# EAGLE design x49_dash (EAGLE 9.3.1)
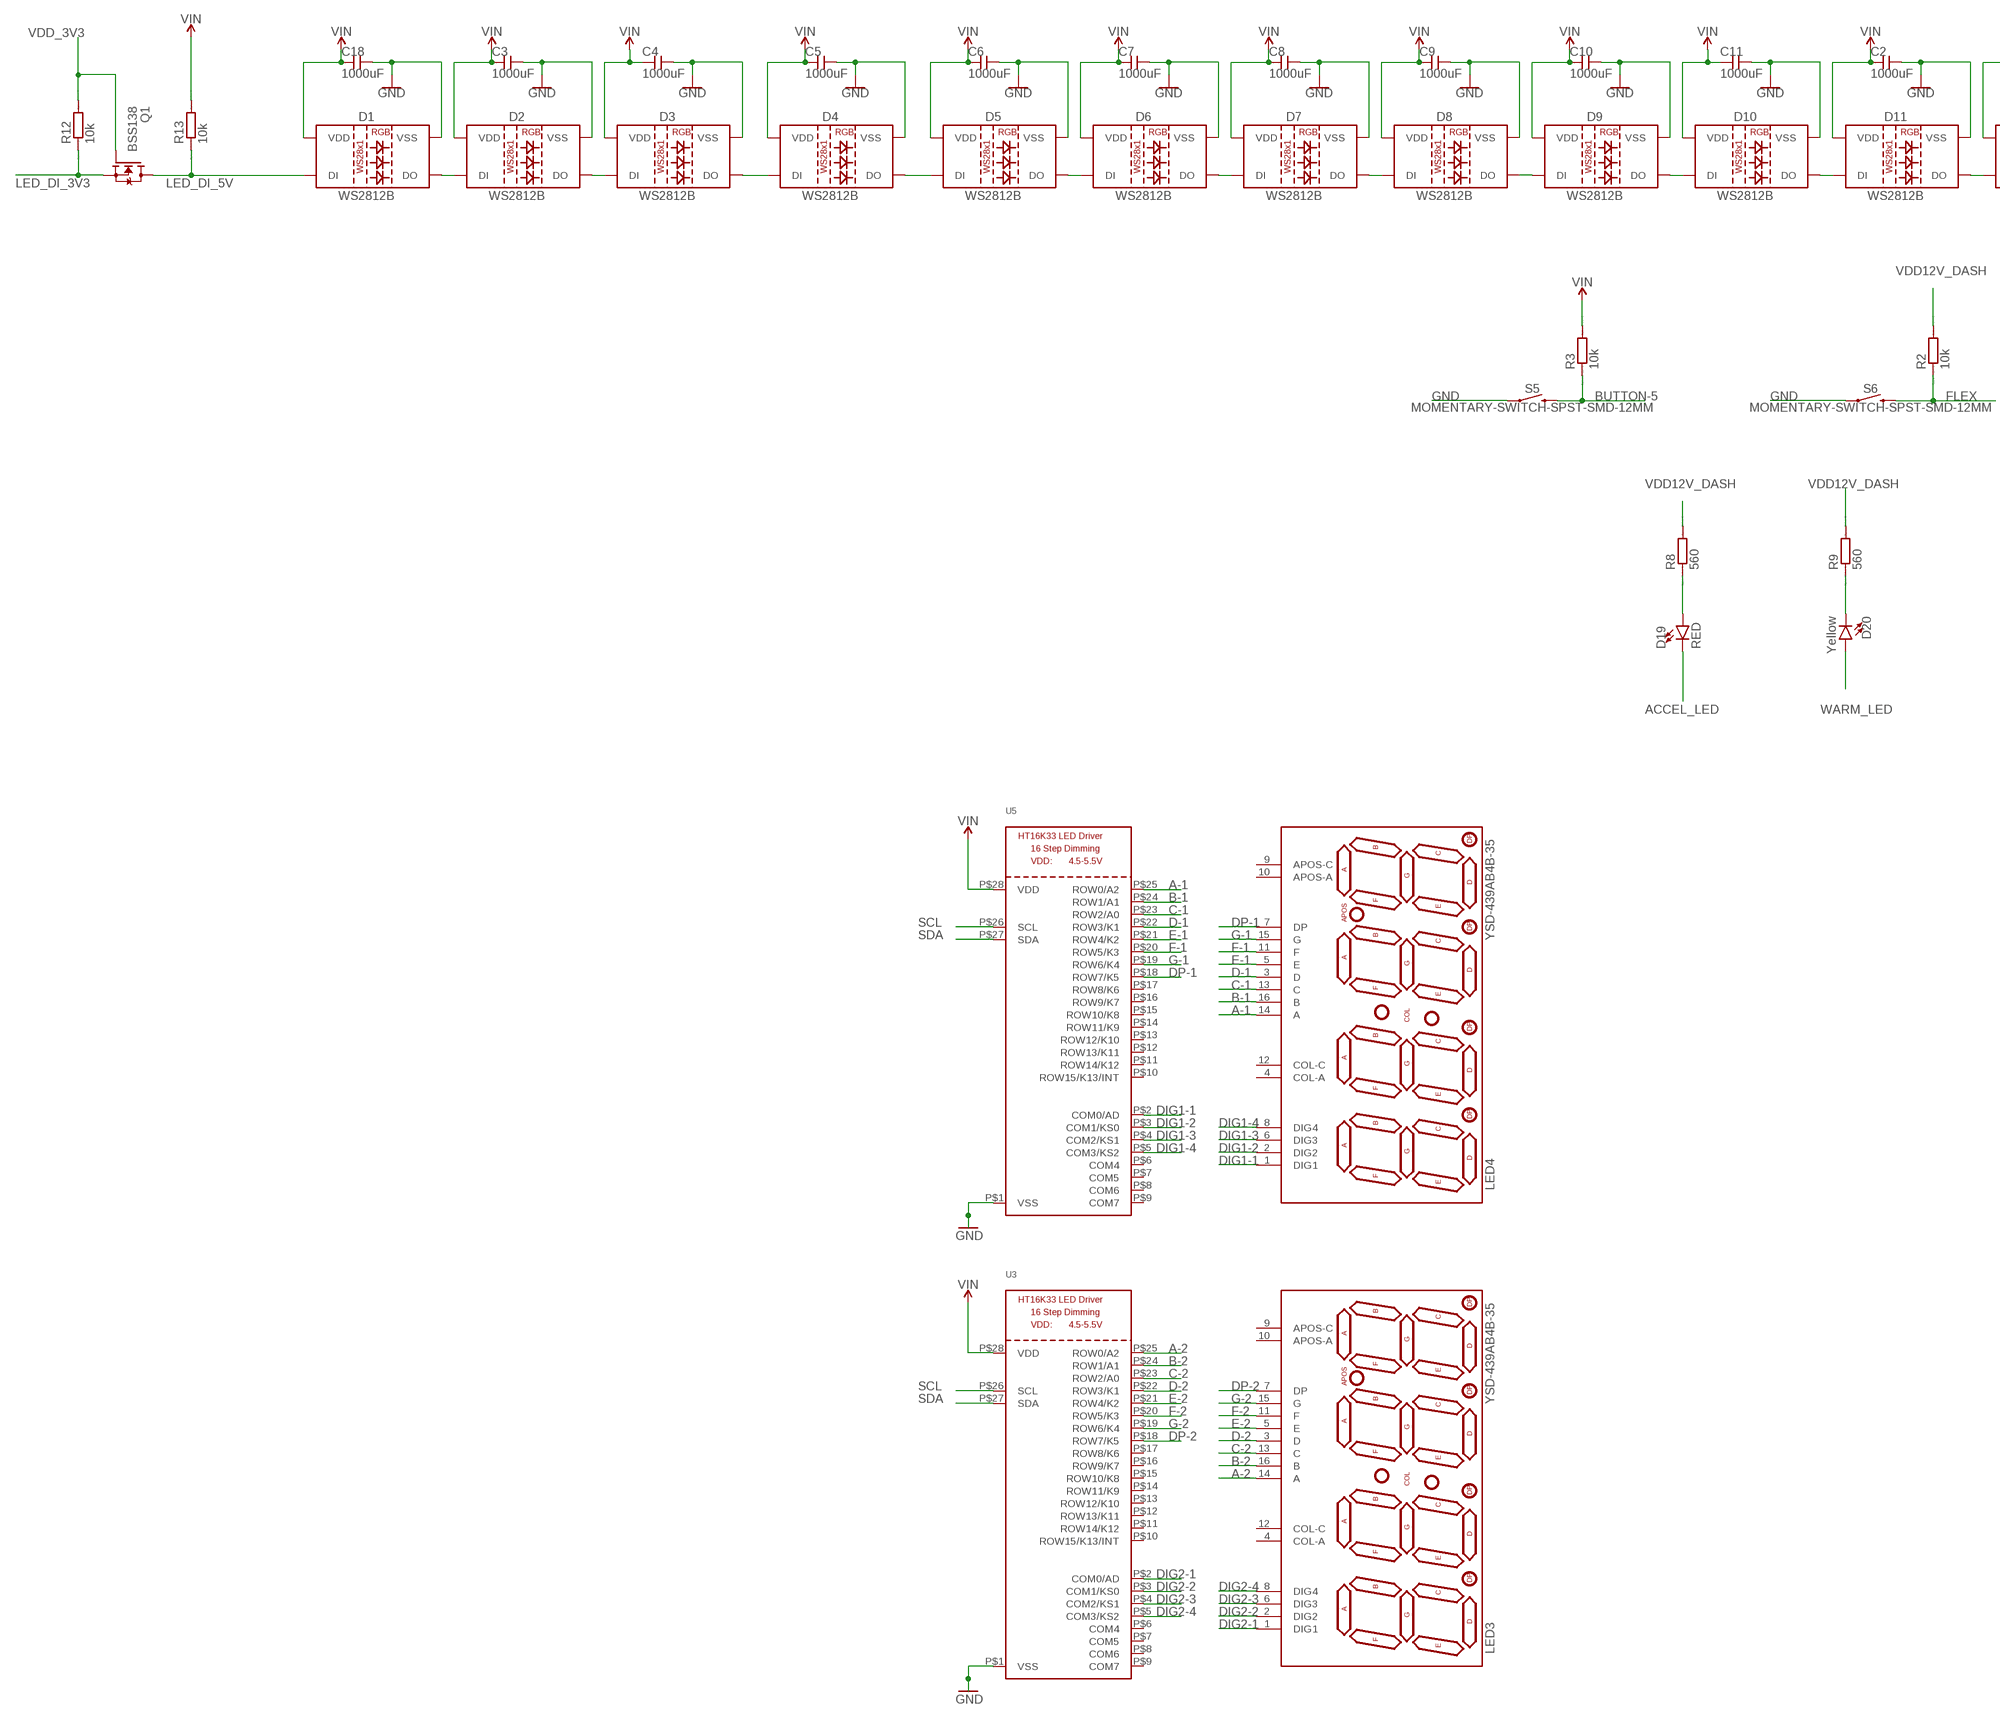
[diagram p0: schematic, sheet 1, part 1 of 2]
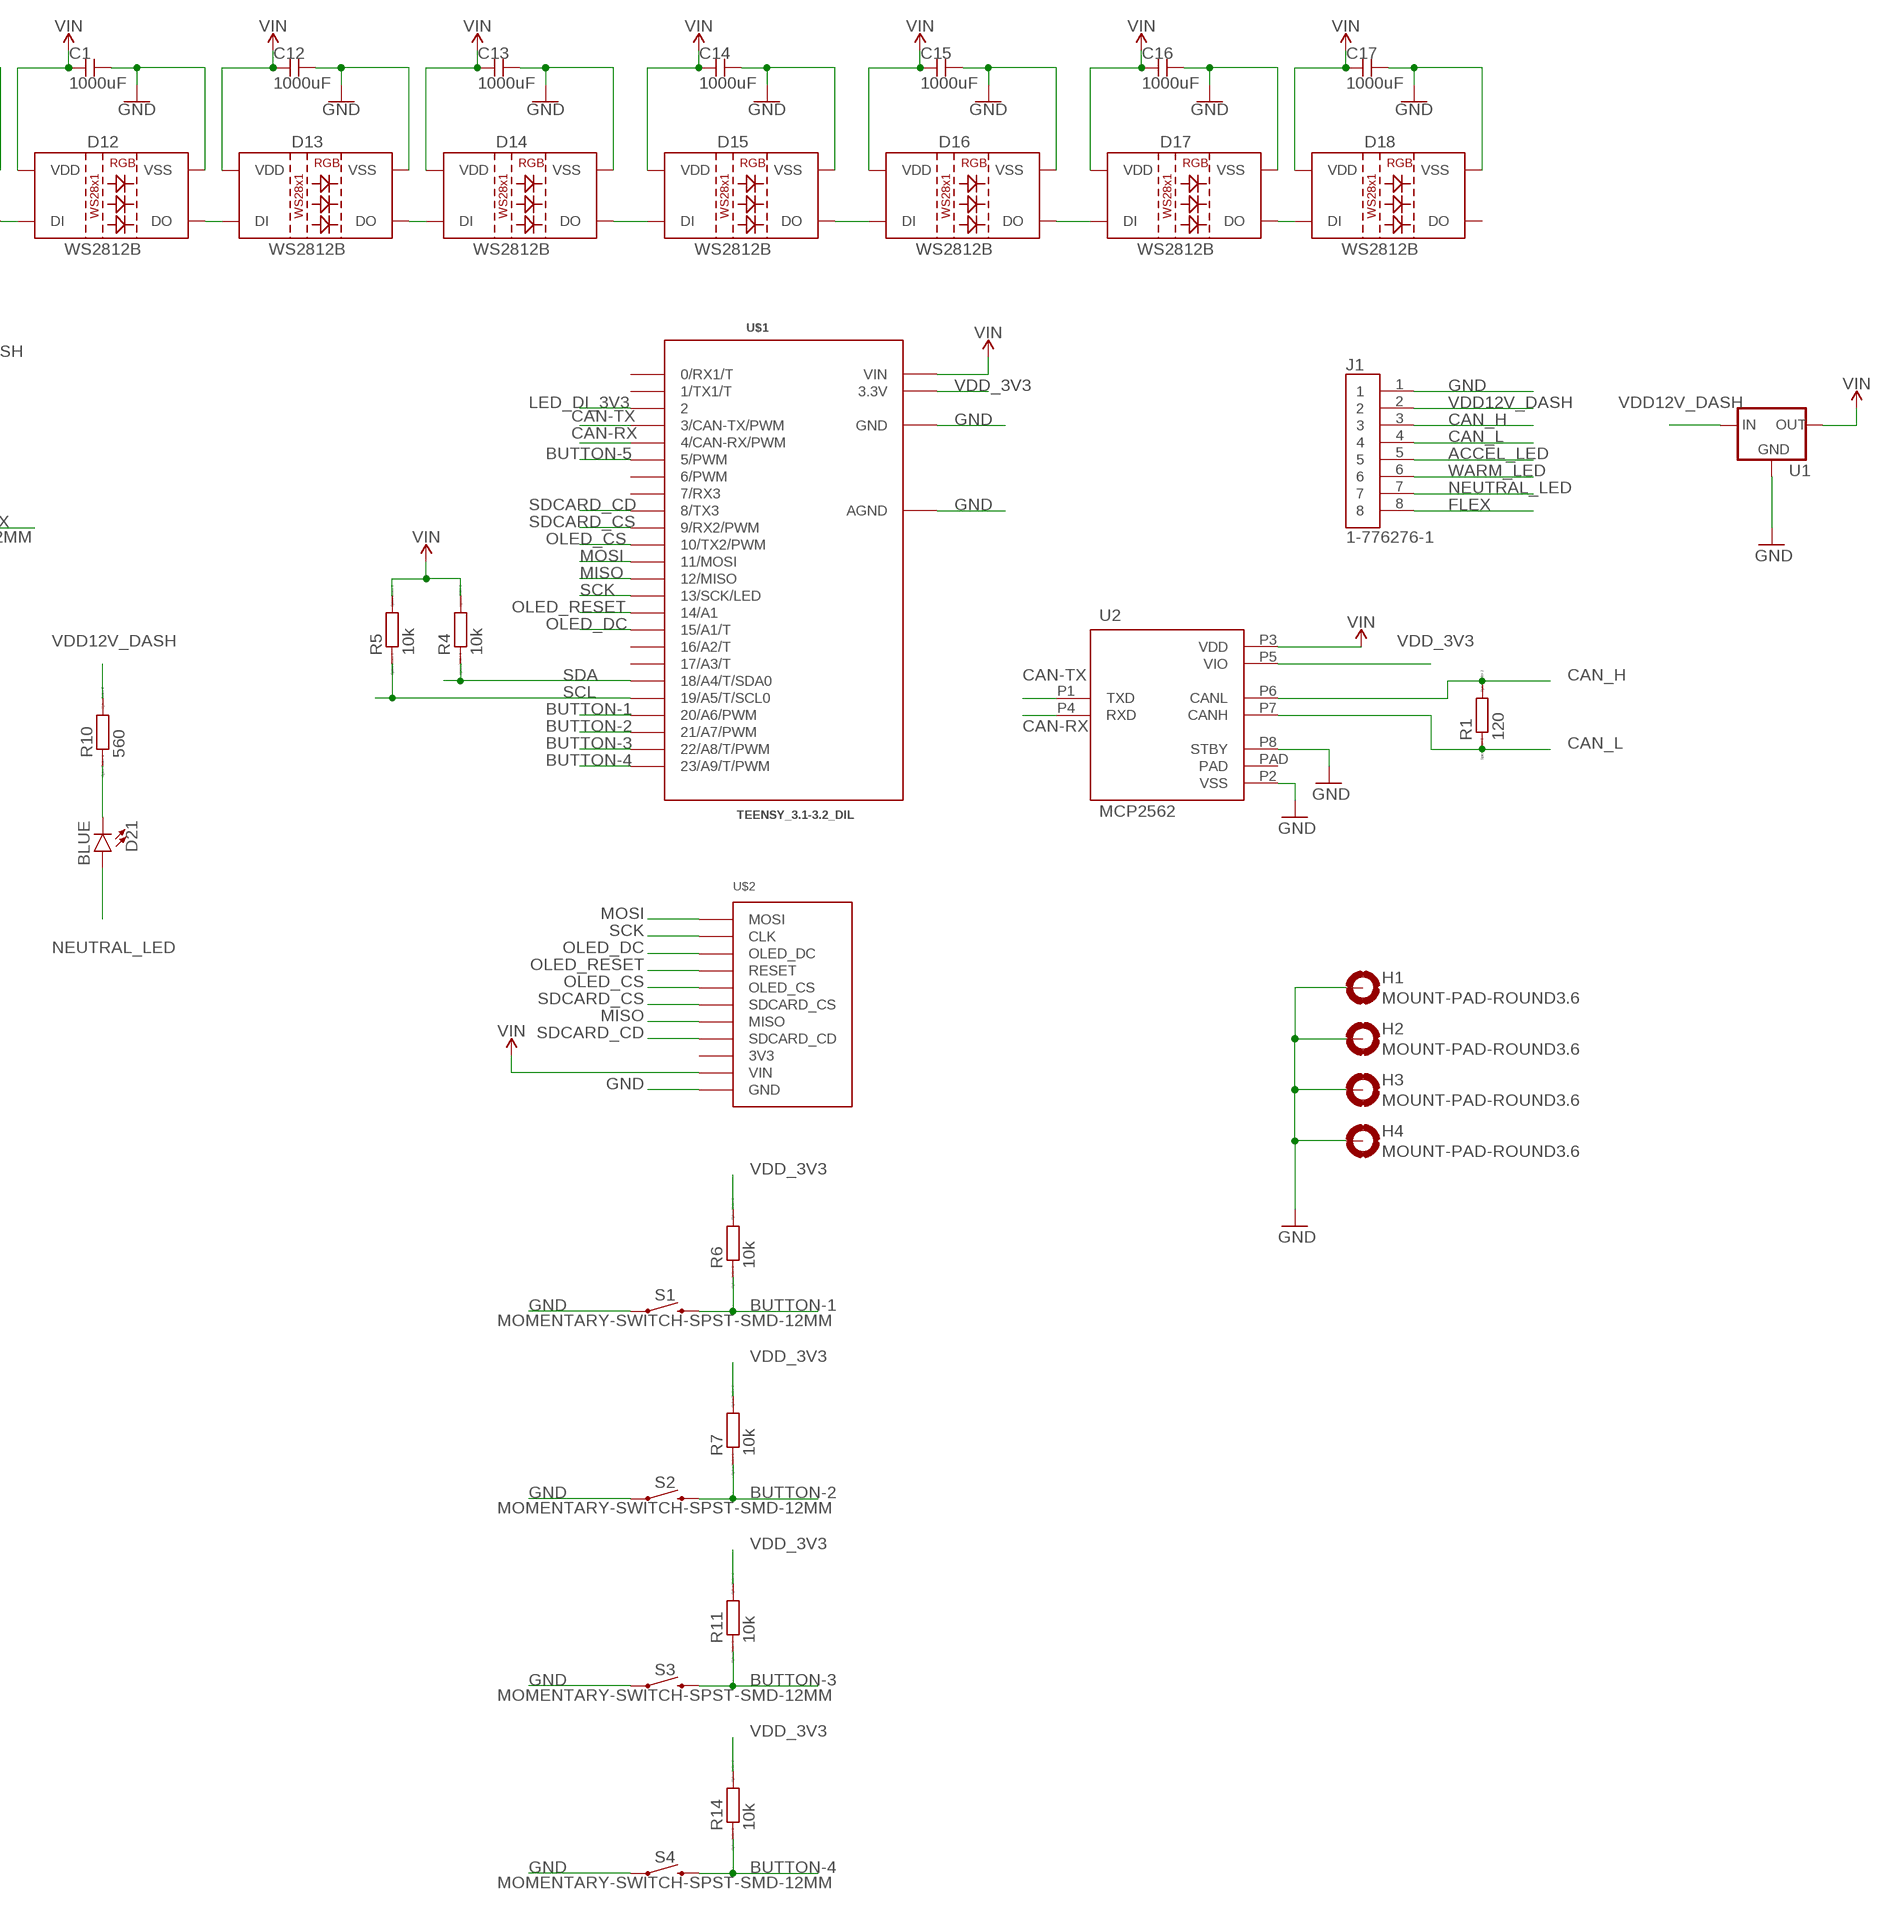
[diagram p1: schematic, sheet 1, part 2 of 2]

## Parts
C1  1000uF  CAP-1005  [1005]
C2  1000uF  CAP-1005  [1005]
C3  1000uF  CAP-1005  [1005]
C4  1000uF  CAP-1005  [1005]
C5  1000uF  CAP-1005  [1005]
C6  1000uF  CAP-1005  [1005]
C7  1000uF  CAP-1005  [1005]
C8  1000uF  CAP-1005  [1005]
C9  1000uF  CAP-1005  [1005]
C10  1000uF  CAP-1005  [1005]
C11  1000uF  CAP-1005  [1005]
C12  1000uF  CAP-1005  [1005]
C13  1000uF  CAP-1005  [1005]
C14  1000uF  CAP-1005  [1005]
C15  1000uF  CAP-1005  [1005]
C16  1000uF  CAP-1005  [1005]
C17  1000uF  CAP-1005  [1005]
C18  1000uF  CAP-1005  [1005]
D1  WS2812B  [WS2812B]
D2  WS2812B  [WS2812B]
D3  WS2812B  [WS2812B]
D4  WS2812B  [WS2812B]
D5  WS2812B  [WS2812B]
D6  WS2812B  [WS2812B]
D7  WS2812B  [WS2812B]
D8  WS2812B  [WS2812B]
D9  WS2812B  [WS2812B]
D10  WS2812B  [WS2812B]
D11  WS2812B  [WS2812B]
D12  WS2812B  [WS2812B]
D13  WS2812B  [WS2812B]
D14  WS2812B  [WS2812B]
D15  WS2812B  [WS2812B]
D16  WS2812B  [WS2812B]
D17  WS2812B  [WS2812B]
D18  WS2812B  [WS2812B]
D19  RED  LED-RED0603  [LED-0603]
D20  Yellow  LED-YELLOW0603  [LED-0603]
D21  BLUE  LED-BLUE0603  [LED-0603]
H1  MOUNT-PAD-ROUND3.6  [3,6-PAD]
H2  MOUNT-PAD-ROUND3.6  [3,6-PAD]
H3  MOUNT-PAD-ROUND3.6  [3,6-PAD]
H4  MOUNT-PAD-ROUND3.6  [3,6-PAD]
J1  1-776276-1  [TE_1-776276-1]
LED3  YSD-439AB4B-35  7-SEGMENT-4DIGIT-10MM-BLUE  [7-SEGMENT-4DIGIT-YOUNGSUN]
LED4  YSD-439AB4B-35  7-SEGMENT-4DIGIT-10MM-BLUE  [7-SEGMENT-4DIGIT-YOUNGSUN]
Q1  BSS138  [SOT23]
R1  120  R  [R0805]
R2  10k  R  [R0805]
R3  10k  R  [R0805]
R4  10k  R  [R0805]
R5  10k  R  [R0805]
R6  10k  R  [R0805]
R7  10k  R  [R0805]
R8  560  R  [R0805]
R9  560  R  [R0805]
R10  560  R  [R0805]
R11  10k  R  [R0805]
R12  10k  R  [R0805]
R13  10k  R  [R0805]
R14  10k  R  [R0805]
S1  MOMENTARY-SWITCH-SPST-SMD-12MM  [TACTILE_SWITCH_SMD_12MM]
S2  MOMENTARY-SWITCH-SPST-SMD-12MM  [TACTILE_SWITCH_SMD_12MM]
S3  MOMENTARY-SWITCH-SPST-SMD-12MM  [TACTILE_SWITCH_SMD_12MM]
S4  MOMENTARY-SWITCH-SPST-SMD-12MM  [TACTILE_SWITCH_SMD_12MM]
S5  MOMENTARY-SWITCH-SPST-SMD-12MM  [TACTILE_SWITCH_SMD_12MM]
S6  MOMENTARY-SWITCH-SPST-SMD-12MM  [TACTILE_SWITCH_SMD_12MM]
U1  +12v  V_REG_78XX7812  [TO-252]
U2  MCP2562  [DFN3X3]
U3  HT16K33_SOP28  [SOP28_300MIL]
U5  HT16K33_SOP28  [SOP28_300MIL]
U$1  TEENSY_3.1-3.2_DIL  [TEENSY_3.0-3.2&LC_DIL]
U$2  ADAFRUIT-OLED-BREAKOUT  [OLED-1.27INCH-BREAKOUT]

## Nets
A-1: LED4.14(A) U5.P$25(ROW0/A2)
A-2: LED3.14(A) U3.P$25(ROW0/A2)
ACCEL_LED: D19.C J1.5
B-1: LED4.16(B) U5.P$24(ROW1/A1)
B-2: LED3.16(B) U3.P$24(ROW1/A1)
BUTTON-1: R6.1 S1.3 U$1.20/A6(20/A6/PWM)
BUTTON-2: R7.1 S2.3 U$1.21/A7(21/A7/PWM)
BUTTON-3: R11.1 S3.3 U$1.22/A8(22/A8/T/PWM)
BUTTON-4: R14.1 S4.3 U$1.23/A9(23/A9/T/PWM)
BUTTON-5: R3.1 S5.3 U$1.5(5/PWM)
C-1: LED4.13(C) U5.P$23(ROW2/A0)
C-2: LED3.13(C) U3.P$23(ROW2/A0)
CAN-RX: U2.P4(RXD) U$1.4(4/CAN-RX/PWM)
CAN-TX: U2.P1(TXD) U$1.3(3/CAN-TX/PWM)
CAN_H: J1.3 R1.2 U2.P6(CANL)
CAN_L: J1.4 R1.1 U2.P7(CANH)
D-1: LED4.3(D) U5.P$22(ROW3/K1)
D-2: LED3.3(D) U3.P$22(ROW3/K1)
DIG1-1: LED4.1(DIG1) U5.P$2(COM0/AD)
DIG1-2: LED4.2(DIG2) U5.P$3(COM1/KS0)
DIG1-3: LED4.6(DIG3) U5.P$4(COM2/KS1)
DIG1-4: LED4.8(DIG4) U5.P$5(COM3/KS2)
DIG2-1: LED3.1(DIG1) U3.P$2(COM0/AD)
DIG2-2: LED3.2(DIG2) U3.P$3(COM1/KS0)
DIG2-3: LED3.6(DIG3) U3.P$4(COM2/KS1)
DIG2-4: LED3.8(DIG4) U3.P$5(COM3/KS2)
DP-1: LED4.7(DP) U5.P$18(ROW7/K5)
DP-2: LED3.7(DP) U3.P$18(ROW7/K5)
E-1: LED4.5(E) U5.P$21(ROW4/K2)
E-2: LED3.5(E) U3.P$21(ROW4/K2)
F-1: LED4.11(F) U5.P$20(ROW5/K3)
F-2: LED3.11(F) U3.P$20(ROW5/K3)
FLEX: J1.8 R2.1 S6.3
G-1: LED4.15(G) U5.P$19(ROW6/K4)
G-2: LED3.15(G) U3.P$19(ROW6/K4)
GND: C1.P$2 C2.P$2 C3.P$2 C4.P$2 C5.P$2 C6.P$2 C7.P$2 C8.P$2 C9.P$2 C10.P$2 C11.P$2 C12.P$2 C13.P$2 C14.P$2 C15.P$2 C16.P$2 C17.P$2 C18.P$2 D1.3(VSS) D2.3(VSS) D3.3(VSS) D4.3(VSS) D5.3(VSS) D6.3(VSS) D7.3(VSS) D8.3(VSS) D9.3(VSS) D10.3(VSS) D11.3(VSS) D12.3(VSS) D13.3(VSS) D14.3(VSS) D15.3(VSS) D16.3(VSS) D17.3(VSS) D18.3(VSS) H1.B3,6(MOUNT) H2.B3,6(MOUNT) H3.B3,6(MOUNT) H4.B3,6(MOUNT) J1.1 S1.1 S2.1 S3.1 S4.1 S5.1 S6.1 U1.3(GND) U2.P2(VSS) U2.P8(STBY) U3.P$1(VSS) U5.P$1(VSS) U$1.AGND U$1.GND U$2.11(GND) U$2.P$1(GND) U$2.P$2(GND) U$2.P$3(GND) U$2.P$4(GND)
LED_DI_3V3: Q1.2(S) R12.1 U$1.2
LED_DI_5V: D1.4(DI) Q1.3(D) R13.1
MISO: U$1.12(12/MISO) U$2.7(MISO)
MOSI: U$1.11(11/MOSI) U$2.1(MOSI)
N$1: D19.A R8.1
N$2: D1.2(DO) D2.4(DI)
N$3: D20.C R9.1
N$4: D21.C R10.1
N$6: D7.2(DO) D8.4(DI)
N$7: D8.2(DO) D9.4(DI)
N$8: D9.2(DO) D10.4(DI)
N$9: D10.2(DO) D11.4(DI)
N$10: D11.2(DO) D12.4(DI)
N$11: D12.2(DO) D13.4(DI)
N$12: D13.2(DO) D14.4(DI)
N$13: D2.2(DO) D3.4(DI)
N$14: D3.2(DO) D4.4(DI)
N$15: D4.2(DO) D5.4(DI)
N$16: D5.2(DO) D6.4(DI)
N$17: D6.2(DO) D7.4(DI)
N$18: D15.2(DO) D16.4(DI)
N$19: D16.2(DO) D17.4(DI)
N$20: D17.2(DO) D18.4(DI)
N$21: D14.2(DO) D15.4(DI)
NEUTRAL_LED: D21.A J1.7
OLED_CS: U$1.10(10/TX2/PWM) U$2.5(OLED_CS)
OLED_DC: U$1.15/A1(15/A1/T) U$2.3(OLED_DC)
OLED_RESET: U$1.14/A0(14/A1) U$2.4(RESET)
SCK: U$1.13(13/SCK/LED) U$2.2(CLK)
SCL: R5.1 U3.P$26(SCL) U5.P$26(SCL) U$1.19/A5(19/A5/T/SCL0)
SDA: R4.1 U3.P$27(SDA) U5.P$27(SDA) U$1.18/A4(18/A4/T/SDA0)
SDCARD_CD: U$1.8(8/TX3) U$2.8(SDCARD_CD)
SDCARD_CS: U$1.9(9/RX2/PWM) U$2.6(SDCARD_CS)
VDD12V_DASH [pwr]: J1.2 R2.2 R8.2 R9.2 R10.2 U1.1(IN)
VDD_3V3: Q1.1(G) R6.2 R7.2 R11.2 R12.2 R14.2 U2.P5(VIO) U$1.3.3V
VIN [pwr]: C1.P$1 C2.P$1 C3.P$1 C4.P$1 C5.P$1 C6.P$1 C7.P$1 C8.P$1 C9.P$1 C10.P$1 C11.P$1 C12.P$1 C13.P$1 C14.P$1 C15.P$1 C16.P$1 C17.P$1 C18.P$1 D1.1(VDD) D2.1(VDD) D3.1(VDD) D4.1(VDD) D5.1(VDD) D6.1(VDD) D7.1(VDD) D8.1(VDD) D9.1(VDD) D10.1(VDD) D11.1(VDD) D12.1(VDD) D13.1(VDD) D14.1(VDD) D15.1(VDD) D16.1(VDD) D17.1(VDD) D18.1(VDD) R3.2 R4.2 R5.2 R13.2 U1.2(OUT) U2.P3(VDD) U3.P$28(VDD) U5.P$28(VDD) U$1.VIN U$2.10(VIN)
WARM_LED: D20.A J1.6
Unconnected: D18.2(DO) LED3.4(COL-A) LED3.9(APOS-C) LED3.10(APOS-A) LED3.12(COL-C) LED4.4(COL-A) LED4.9(APOS-C) LED4.10(APOS-A) LED4.12(COL-C) U2.PAD U3.P$6(COM4) U3.P$7(COM5) U3.P$8(COM6) U3.P$9(COM7) U3.P$10(ROW15/K13/INT) U3.P$11(ROW14/K12) U3.P$12(ROW13/K11) U3.P$13(ROW12/K10) U3.P$14(ROW11/K9) U3.P$15(ROW10/K8) U3.P$16(ROW9/K7) U3.P$17(ROW8/K6) U5.P$6(COM4) U5.P$7(COM5) U5.P$8(COM6) U5.P$9(COM7) U5.P$10(ROW15/K13/INT) U5.P$11(ROW14/K12) U5.P$12(ROW13/K11) U5.P$13(ROW12/K10) U5.P$14(ROW11/K9) U5.P$15(ROW10/K8) U5.P$16(ROW9/K7) U5.P$17(ROW8/K6) U$1.0(0/RX1/T) U$1.1(1/TX1/T) U$1.6(6/PWM) U$1.7(7/RX3) U$1.16/A2(16/A2/T) U$1.17/A3(17/A3/T)

## Power pins joined to a net without a drawn wire
3V3: U$2.9(3V3)

## Library data of the parts
C1-C18 = scenix4:CAP-1005
D1-D18 = SparkFun-LED:WS2812B: WS2812B SMD addressable RGB LED 5x5mm SMD LED with built-in controller IC. Color: Red/Green/Blue mC Rating: RGB: 390, 660, 180 mcd Forward Voltage: RGB: 2.0, 3.0, 3.0 V Packages:WS2812B SparkFun Products: Blynk Board - ESP8266 <https://www.sparkfun.com/products/13794>; PROD_ID: DIO-12503
D19 = SparkFun-LED:LED-RED: Red SMD LED Used in manufacturing of most products at SparkFun Packages: 0603 - SMD 0603 package [Product Link] <http://docs.avagotech.com/docs/AV02-0551EN> 0603 SMART - SMD 0603 SMART package ( more efficient and expensive)[Product Link] <http://www.osram-os.com/Graphics/XPic2/00077099_0.pdf> 1206 - SMD1206 package [Product Link] <https://www.sparkfun.com/datasheets/DevTools/LilyPad/Q150OVS4.pdff> SparkFun Products: Pro Mini 328 -5V <https://www.sparkfun.com/products/821> RedBoard <https://www.sparkfun.com/products/12757> IOIO-OTG <https://www.sparkfun.com/products/13613>; PROD_ID: DIO-00819
D20 = SparkFun-LED:LED-YELLOW: Yellow SMD LED Used in manufacturing several products at SparkFun. Packages: 0603 - SMD 0603 package[Product Link] <http://www.kingbrightusa.com/product.asp?catalog_name=LED&product_id=APT1608SYCK> 0603 -SMART - SMART SMD 0603 package (more efficient/more expensive) [Product Link] <http://www.osram-os.com/osram_os/en/products/product-catalog/led-light-emitting-diodes/smartled-0603/ly-l29k/index.jsp> LilyPad - SMD1206 package[Product Datasheet] <https://www.sparkfun.com/datasheets/DevTools/LilyPad/Q150YUS4.pdf> SparkFun Products: Blynk Board <https://www.sparkfun.com/products/13794> IOIO-OTG <https://www.sparkfun.com/products/13613> XBee Explorer Serial <https://www.sparkfun.com/products/13225>; PROD_ID: DIO-09003
D21 = SparkFun-LED:LED-BLUE: Blue SMD LED Used in manufacturing of various products at SparkFun Packages: 0603 - SMD 0603 package [Product Link] <http://www.digikey.com/product-detail/en/SMLE12BC7TT86/511-1589-2-ND/1641808> 1206 - SMD1206 package [Product Link] <http://www.digikey.com/product-detail/en/lite-on-inc/LTST-C150TBKT/160-1643-1-ND/573584> SparkFun Products: ESP8266 Thing-Dev Board <https://www.sparkfun.com/products/13711> RedBoard <https://www.sparkfun.com/products/12757>; PROD_ID: DIO-08575
H1-H4 = holes:MOUNT-PAD-ROUND: MOUNTING PAD, round
J1 = 1-776276-1:1-776276-1: CONN HEADER 8POS VERT GOLD BLK; MANUFACTURER: TE Connectivity; METADATA: Manufacturer recommendations; PARTREV: B9
LED3 LED4 = SparkFun-LED:7-SEGMENT-4DIGIT-10MM: 4 Digit 7 Segment Display This is a part for the 4-Digit 7-segment LEDs from Young Sun. Different from the Digikey LEDs, all 16 pins are used. The LONGPADS Variant is used for a test jig, but you may like it because there is more pad to solder to. If you are concerned about routing space, the standard works just fine though. Datasheets: Red <http://www.sparkfun.com/datasheets/Components/LED/7-Segment/YSD-439AR6B-35.pdf> Yellow <http://www.sparkfun.com/datasheets/Components/LED/7-Segment/YSD-439AY2B-35.pdf> Kelly Green <http://www.sparkfun.com/datasheets/Components/LED/7-Segment/YSD-439AK2B-35.pdf> Blue <http://www.sparkfun.com/datasheets/Components/LED/7-Segment/YSD-439AB4B-35.pdf> White <http://cdn.sparkfun.com/datasheets/Components/LED/ATA3492BW_2.pdf> SparkFun Products Raw Components 7-Segment Display - 4-Digit (Red) <https://www.sparkfun.com/products/9483> (COM-09483) 7-Segment Display - 4-Digit (Yellow) <https://www.sparkfun.com/products/9480> (COM-09480) 7-Segment Display - 4-Digit (Kelly Green) <https://www.sparkfun.com/products/9482> (COM-09482) 7-Segment Display - 4-Digit (Blue) <https://www.sparkfun.com/products/9481> (COM-09481) 7-Segment Display - 4-Digit (White) <https://www.sparkfun.com/products/10931> ( COM-10931) Serial Controlled SparkFun 7-Segment Serial Display - Red <https://www.sparkfun.com/products/11441> (COM-11441) SparkFun 7-Segment Serial Display - Yellow <https://www.sparkfun.com/products/11443> (COM-11443) SparkFun 7-Segment Serial Display - Kelly Green <https://www.sparkfun.com/products/11440> (COM-11440) SparkFun 7-Segment Serial Display - Blue <https://www.sparkfun.com/products/11442> (COM-11442) SparkFun 7-Segment Serial Display - White <https://www.sparkfun.com/products/11629> (COM-11629) Other SparkFun BigTime Watch Kit <https://www.sparkfun.com/products/11734> (KIT-11734); PROD_ID: COMP-09664
Q1 = bss138_10:BSS138: BSS138 N-Channel Logic Level Enhancement Mode Field Effect Transistor Source: http://www.fairchildsemi.com/datasheets/BS/BSS138.pdf; MF: Fairchild; MPN: BSS138; OC_FARNELL: 9845330; OC_NEWARK: 67R2009
R1-R14 = eagle-ltspice:R: RESISTOR, European symbol; SPICEMODEL: NONE; SPICEPREFIX: R
S1-S6 = SparkFun-Switches:MOMENTARY-SWITCH-SPST: Momentary Switch (Pushbutton) - SPST Normally-open (NO) SPST momentary switches (buttons, pushbuttons). Variants PTH-12MM - 12mm square, through-hole Momentary Pushbutton Switch - 12mm Square <https://www.sparkfun.com/products/9190> (COM-09190) PTH-6.0MM, PTH-6.0MM-KIT - 6.0mm square, through-hole Mini Pushbutton Switch <https://www.sparkfun.com/products/97> (COM-00097) KIT package intended for soldering kit's - only one side of pads' copper is exposed. PTH-RIGHT-ANGLE-KIT - Right-angle, through-hole Right Angle Tactile Button <https://www.sparkfun.com/products/10791> - Used on SparkFun BigTime Watch Kit <https://www.sparkfun.com/products/11734> SMD-12MM - 12mm square, surface-mount Tactile Button - SMD (12mm) <https://www.sparkfun.com/products/12993> (COM-12993) Used on SparkFun PicoBoard <https://www.sparkfun.com/products/11888> SMD-4.5MM - 4.5mm Square Trackball Switch Used on SparkFun Blackberry Trackballer Breakout <https://www.sparkfun.com/products/13169> SMD-4.6MMX2.8MM - 4.60mm x 2.80mm, surface mount Used on SparkFun SAMD21 Mini Breakout <https://www.sparkfun.com/products/13664> SMD-5.2MM, SMD-5.2-REDUNDANT - 5.2mm square, surface-mount Mini Pushbutton Switch - SMD <https://www.sparkfun.com/products/8720> (COM-08720) Used on Arduino Pro Mini <https://www.sparkfun.com/products/11114> REDUNDANT package connects both switch circuits together SMD-6.0X3.5MM - 6.0 x 3.5mm, surface mount Momentary Reset Switch SMD <https://www.sparkfun.com/products/8229> (COM-08229) SMD-6.2MM-TALL - 6.2mm square, surface mount Tactile Button - SMD (6mm) <https://www.sparkfun.com/products/12992> Used on SparkFun Digital Sandbox <https://www.sparkfun.com/products/12651> SMD-RIGHT-ANGLE - Right-angle, surface mount Used on SparkFun Block for Intel® Edison - Arduino <https://www.sparkfun.com/products/13036>; PROD_ID: SWCH-11967; SF_SKU: COM-12993
U1 = SparkFun-IC-Power:V_REG_78XX: Voltage Regulator Standard 78xx regulator. IGO (Input Ground Output). Spark Fun Electronics SKU : COM-00107; PROD_ID: VREG-12370
U2 = can:MCP2562
U3 U5 = microbuilder:HT16K33_SOP28
U$1 = Teensy_3_and_LC_Series_Boards_v1.4:TEENSY_3.1-3.2_DIL: Teensy 3.1 or 3.2 in a DIL Layout.
U$2 = adafruit:ADAFRUIT-OLED-BREAKOUT

## Net classes
0 default: width 0.254 mm, drill 0.55 mm
1 pwr: width 0.508 mm, drill 0.55 mm

## Board
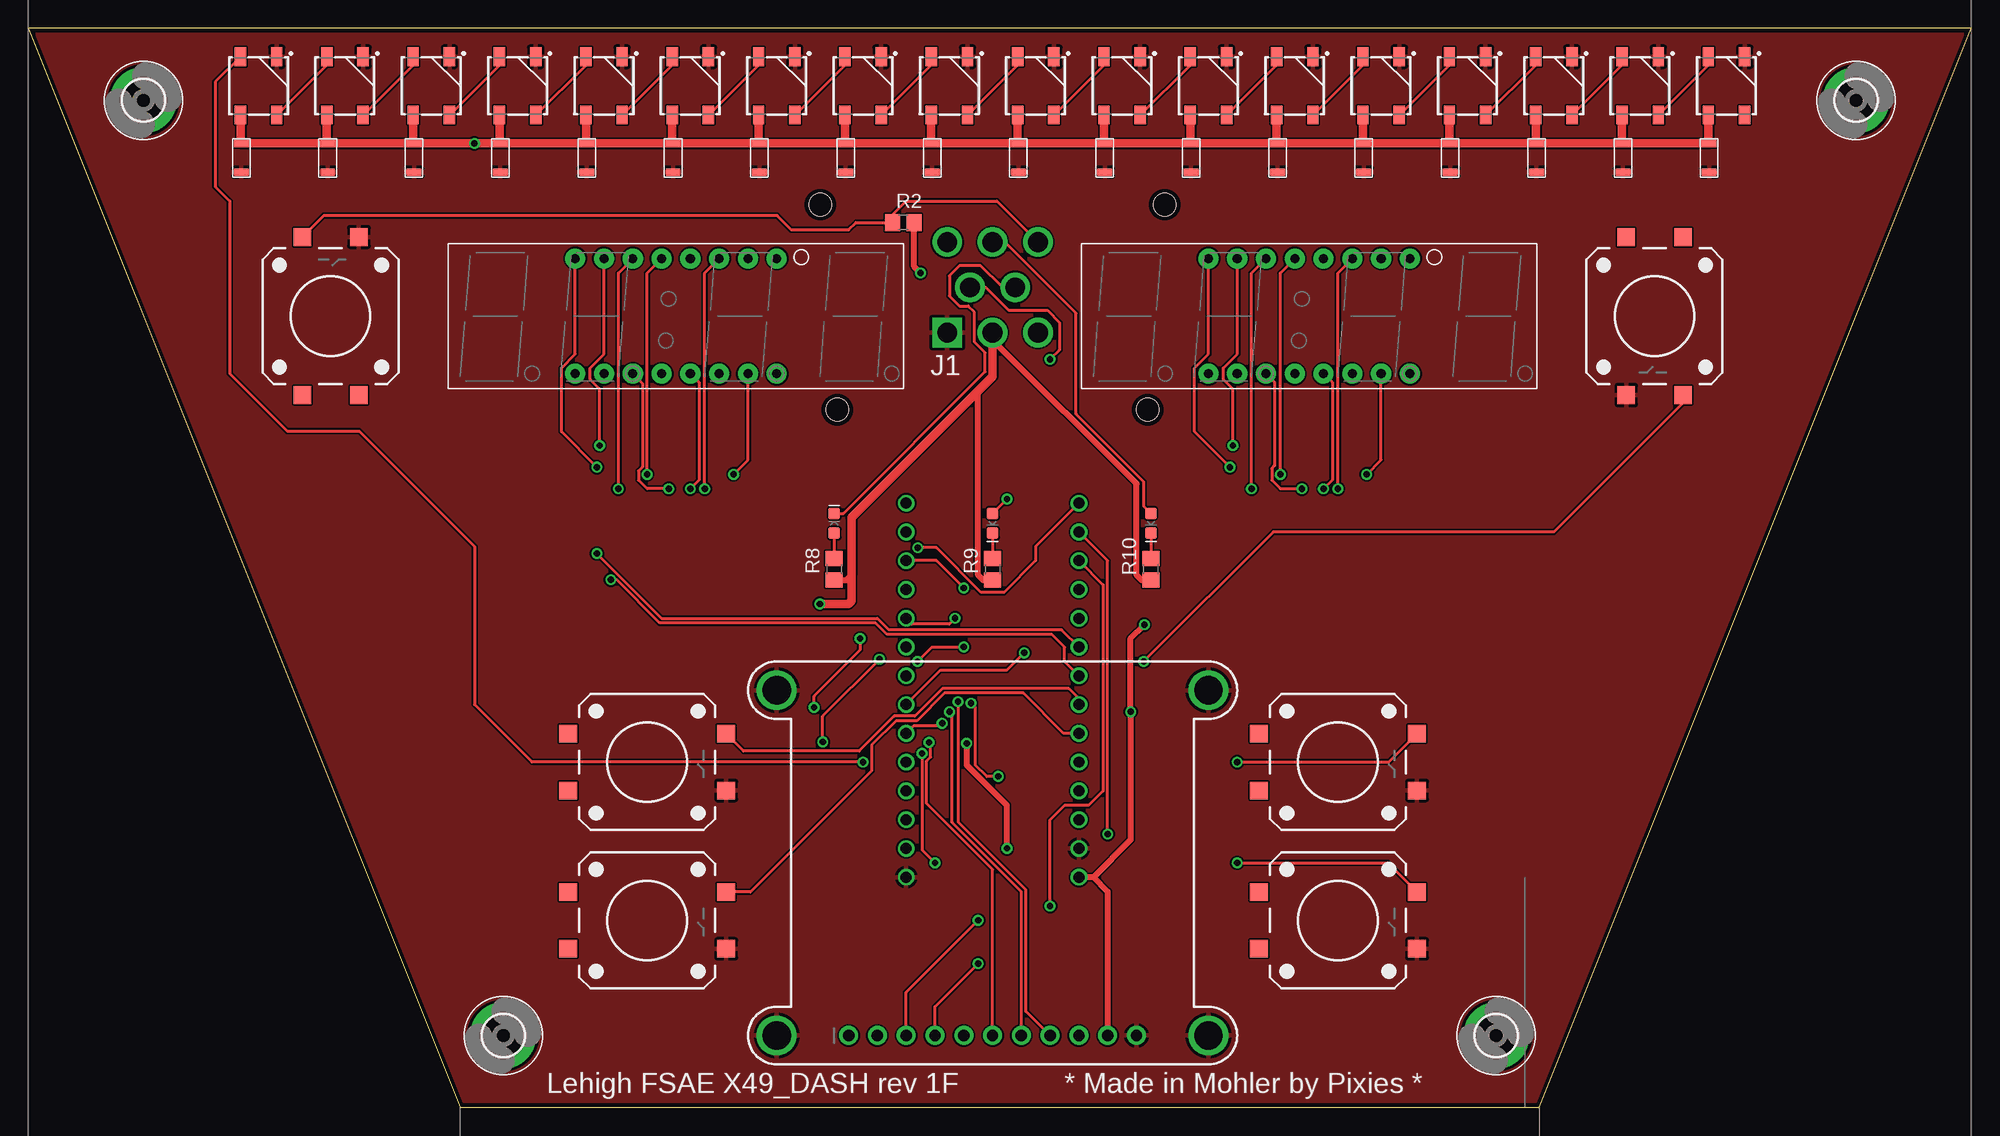
[diagram p2: board, top side]
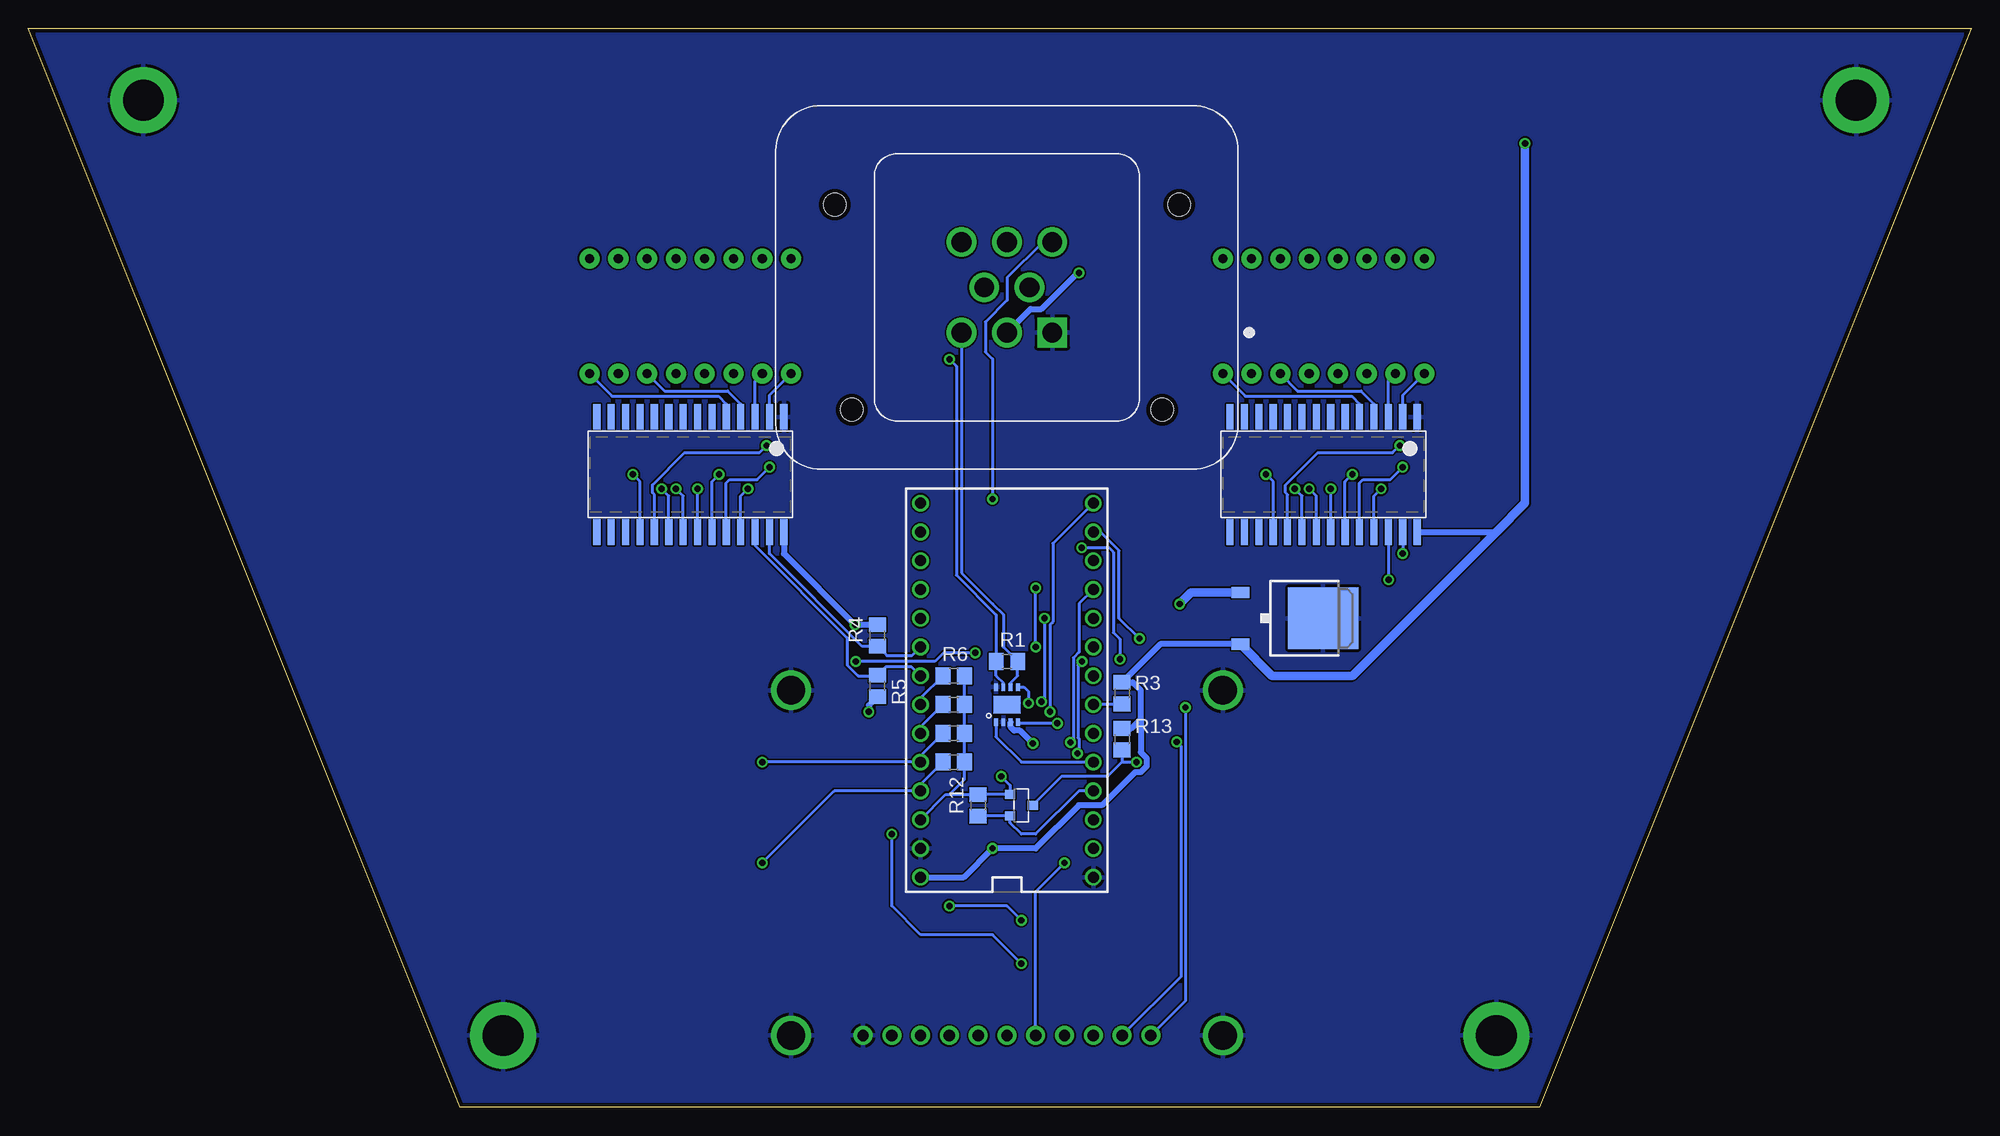
[diagram p3: board, bottom side, seen from below]

Size 171.45 x 95.25 mm. Coordinates in mm from the lower left corner, seen from the top.
Outline: 38.1,0 133.36,0 171.45,95.25 0,95.25 38.1,0
Copper layers (1*16): Top 0.035559375mm / dielectric 1.501140625mm / Bottom 0.035559375mm
Design rules "typical_4pcb": minimum track width 10mil, minimum drill 15mil, track to track 6mil, track to pad 6mil, pad to pad 6mil, via to via 6mil, smd to smd 6mil, copper to edge 15mil, drill to drill 8mil, minimum pad ring 10mil, minimum via ring 8mil, stop-mask expansion 4mil, vias tented up to drill 0mil, thermal gap 10mil

### Footprints (pad centres in the part's own frame; a part is rotated, then mirrored left to right if it is on the bottom)
1005 = smd 0.635 x 1.27: P$1 1.27,0; P$2 -1.27,0
WS2812B = smd 1.651 x 1: 1 2.577,-1.6; 2 2.577,1.6; 3 -2.577,1.6; 4 -2.577,-1.6
LED-0603 = smd 1 x 1: A -0.877,0; C 0.877,0
3,6-PAD = drill 3.6 pad 5.842: B3,6 0,0
TE_1-776276-1 = drill 1.75 square: 1 -4,4 | drill 1.75: 2 0,4; 3 4,4; 4 -2,0; 5 2,0; 6 -4,-4; 7 0,-4; 8 4,-4 | hole 2: -13.7,10.8; 13.7,10.8; -15.2,-7.3; 15.2,-7.3
7-SEGMENT-4DIGIT-YOUNGSUN = drill 0.8 pad 1.778: 1 -8.89,-5.08; 2 -6.35,-5.08; 3 -3.81,-5.08; 4 -1.27,-5.08; 5 1.27,-5.08; 6 3.81,-5.08; 7 6.35,-5.08; 8 8.89,-5.08; 9 8.89,5.08; 10 6.35,5.08; 11 3.81,5.08; 12 1.27,5.08; 13 -1.27,5.08; 14 -3.81,5.08; 15 -6.35,5.08; 16 -8.89,5.08
SOT23 = smd 0.8 x 0.9: 1 -0.95,-1; 2 0.95,-1; 3 0,1
R0805 = smd 1.3 x 1.5: 1 -0.95,0; 2 0.95,0
TACTILE_SWITCH_SMD_12MM = smd 1.6 x 1.55: 1 6.975,-2.5; 2 -6.975,-2.5; 3 6.975,2.5; 4 -6.975,2.5
TO-252 = smd 1 x 1.6: 1 -2.28,-4.8; 2 2.28,-4.8 | smd 5.4 x 6.2: 3 0,2.5
DFN3X3 = smd 0.35 x 0.65: P1 -0.975,-1.55; P2 -0.325,-1.55; P3 0.325,-1.55; P4 0.975,-1.55; P5 0.975,1.55; P6 0.325,1.55; P7 -0.325,1.55; P8 -0.975,1.55 | smd 2.4 x 1.55: PAD 0,0
SOP28_300MIL = smd 0.635 x 2.286: P$1 -8.255,-5.08; P$2 -6.985,-5.08; P$3 -5.715,-5.08; P$4 -4.445,-5.08; P$5 -3.175,-5.08; P$6 -1.905,-5.08; P$7 -0.635,-5.08; P$8 0.635,-5.08; P$9 1.905,-5.08; P$10 3.175,-5.08; P$11 4.445,-5.08; P$12 5.715,-5.08; P$13 6.985,-5.08; P$14 8.255,-5.08; P$15 8.255,5.08; P$16 6.985,5.08; P$17 5.715,5.08; P$18 4.445,5.08; P$19 3.175,5.08; P$20 1.905,5.08; P$21 0.635,5.08; P$22 -0.635,5.08; P$23 -1.905,5.08; P$24 -3.175,5.08; P$25 -4.445,5.08; P$26 -5.715,5.08; P$27 -6.985,5.08; P$28 -8.255,5.08
TEENSY_3.0-3.2&LC_DIL = drill 0.965: 0 -7.62,13.97; 1 -7.62,11.43; 2 -7.62,8.89; 3 -7.62,6.35; 3.3V 7.62,11.43; 4 -7.62,3.81; 5 -7.62,1.27; 6 -7.62,-1.27; 7 -7.62,-3.81; 8 -7.62,-6.35; 9 -7.62,-8.89; 10 -7.62,-11.43; 11 -7.62,-13.97; 12 -7.62,-16.51; 13 7.62,-16.51; 14/A0 7.62,-13.97; 15/A1 7.62,-11.43; 16/A2 7.62,-8.89; 17/A3 7.62,-6.35; 18/A4 7.62,-3.81; 19/A5 7.62,-1.27; 20/A6 7.62,1.27; 21/A7 7.62,3.81; 22/A8 7.62,6.35; 23/A9 7.62,8.89; AGND 7.62,13.97; GND -7.62,16.51; VIN 7.62,16.51
OLED-1.27INCH-BREAKOUT = drill 1 pad 1.676: 1 12.7,15.24; 2 10.16,15.24; 3 7.62,15.24; 4 5.08,15.24; 5 2.54,15.24; 6 0,15.24; 7 -2.54,15.24; 8 -5.08,15.24; 9 -7.62,15.24; 10 -10.16,15.24; 11 -12.7,15.24 | drill 2.5 pad 3.2: P$1 -19.05,15.24; P$2 19.05,15.24; P$3 -19.05,-15.24; P$4 19.05,-15.24

### Placement (x,y rotation side)
C1  18.8,83.82 90 top
C2  26.42,83.82 90 top
C3  34.04,83.82 90 top
C4  41.66,83.82 90 top
C5  49.28,83.82 90 top
C6  56.9,83.82 90 top
C7  64.52,83.82 90 top
C8  72.14,83.82 90 top
C9  79.76,83.82 90 top
C10  87.38,83.82 90 top
C11  95,83.82 90 top
C12  102.62,83.82 90 top
C13  110.24,83.82 90 top
C14  117.86,83.82 90 top
C15  125.48,83.82 90 top
C16  133.1,83.82 90 top
C17  140.72,83.82 90 top
C18  148.34,83.82 90 top
D1  20.32,90.17 270 top
D2  27.94,90.17 270 top
D3  35.56,90.17 270 top
D4  43.18,90.17 270 top
D5  50.8,90.17 270 top
D6  58.42,90.17 270 top
D7  66.04,90.17 270 top
D8  73.66,90.17 270 top
D9  81.28,90.17 270 top
D10  88.9,90.17 270 top
D11  96.52,90.17 270 top
D12  104.14,90.17 270 top
D13  111.76,90.17 270 top
D14  119.38,90.17 270 top
D15  127,90.17 270 top
D16  134.62,90.17 270 top
D17  142.24,90.17 270 top
D18  149.86,90.17 270 top
D19  71.12,51.56 90 top
D20  85.09,51.56 270 top
D21  99.06,51.56 270 top
H1  161.29,88.9 0 top
H2  129.54,6.35 0 top
H3  10.16,88.9 0 top
H4  41.91,6.35 0 top
J1  85.09,72.39 180 bottom
LED3  57.15,69.85 0 top
LED4  113.03,69.85 0 top
Q1  83.82,26.67 270 bottom
R1  85.09,39.37 0 bottom
R2  77.22,78.11 0 top
R3  74.93,36.58 90 bottom
R4  96.52,41.66 90 bottom
R5  96.52,37.21 270 bottom
R6  89.79,38.1 0 bottom
R7  89.79,35.56 0 bottom
R8  71.12,47.5 270 top
R9  85.09,47.5 270 top
R10  99.06,47.5 270 top
R11  89.79,33.02 0 bottom
R12  87.63,26.67 90 bottom
R13  74.93,32.51 90 bottom
R14  89.79,30.48 0 bottom
S1  54.61,30.48 0 top
S2  54.61,16.51 0 top
S3  115.57,30.48 0 top
S4  115.57,16.51 0 top
S5  143.51,69.85 270 top
S6  26.67,69.85 90 top
U1  59.69,43.18 270 bottom
U2  85.09,35.56 0 bottom
U3  57.15,55.88 180 bottom
U5  113.03,55.88 180 bottom
U$1  85.09,36.83 180 bottom
U$2  85.09,21.59 180 top

### Tracks (layer width: path | path; a pad name or v marks a point on that pad's centre or on a via)
A-1  (via drill 0.55)
  Top 0.254: v107.95,54.61 107.95,73.66 LED4.14
  Bottom 0.254: U5.P$25 108.59,53.98 v107.95,54.61
A-2  (via drill 0.55)
  Top 0.254: v52.07,54.61 52.07,73.66 LED3.14
  Bottom 0.254: U3.P$25 52.7,53.98 v52.07,54.61
ACCEL_LED
  Top 0.254: D19.C 71.93,52.44 84.43,64.94 84.43,66.62 83.49,67.56 83.49,70.18 82.93,70.74 82.17,70.74 81.28,71.63 81.28,73.41 82.17,74.3 84.04,74.3 85.95,72.39 J1.5
B-1  (via drill 0.55)
  Top 0.254: LED4.16 104.14,66.5 102.92,65.28 102.92,59.64 v106.05,56.52
  Bottom 0.254: v106.05,56.52 107.14,55.42 109.56,55.42 109.86,55.12 U5.P$24
B-2  (via drill 0.55)
  Top 0.254: LED3.16 48.26,66.5 47.04,65.28 47.04,59.64 v50.17,56.52
  Bottom 0.254: v50.17,56.52 51.26,55.42 53.68,55.42 53.98,55.12 U3.P$24
BUTTON-1
  Top 0.254: S1.3 63.11,31.46 73.33,31.46 76.41,34.54 78.24,34.54 80.67,36.98 91.82,36.98 92.71,36.09 U$1.20/A6
  Bottom 0.254: R6.1 92.71,36.13 U$1.20/A6
BUTTON-2
  Top 0.254: S2.3 63.72,19.01 74.42,29.72 74.42,31.98 76.58,34.14 78.41,34.14 80.84,36.57 87.82,36.57 91.37,33.02 U$1.21/A7
  Bottom 0.254: R7.1 92.71,33.59 U$1.21/A7
BUTTON-3  (via drill 0.55)
  Top 0.254: v106.68,30.48 120.05,30.48 S3.3
  Bottom 0.254: R11.1 92.71,31.05 U$1.22/A8 v106.68,30.48
BUTTON-4  (via drill 0.55)
  Top 0.254: S4.3 119.97,21.59 v106.68,21.59
  Bottom 0.254: v106.68,21.59 100.33,27.94 U$1.23/A9 92.71,28.51 R14.1
BUTTON-5  (via drill 0.55)
  Top 0.254: v87.88,40.13 86.36,38.61 80.52,38.61 U$1.5 | S5.3 146.01,62.19 134.62,50.8 109.86,50.8 v98.43,39.37
  Bottom 0.254: v87.88,40.13 90.68,40.13 91.44,39.37 v98.43,39.37 | R3.1 75,35.56 U$1.5
C-1  (via drill 0.55)
  Top 0.254: v110.49,55.88 110.49,73.66 LED4.13
  Bottom 0.254: U5.P$23 111.12,55.24 v110.49,55.88
C-2  (via drill 0.55)
  Top 0.254: v54.61,55.88 54.61,73.66 LED3.13
  Bottom 0.254: U3.P$23 55.25,55.24 v54.61,55.88
CAN-RX  (via drill 0.55)
  Top 0.254: v80.65,33.91 80.39,33.66 78.11,33.66 U$1.4
  Bottom 0.254: U2.P4 84.01,33.91 v80.65,33.91
CAN-TX
  Bottom 0.254: U$1.3 83.82,30.48 86.06,32.73 U2.P1
CAN_H
  Bottom 0.254: U2.P6 84.77,37.48 84.14,38.1 R1.2 85.41,40.64 85.41,43.5 86.36,44.45 89.09,47.18 J1.3
CAN_L  (via drill 0.55)
  Top 0.254: J1.4 84.49,72.39 86.52,70.36 89.92,70.36 90.98,69.29 90.98,66.85 v90.17,66.04
  Bottom 0.254: U2.P7 85.41,37.48 86.04,38.1 R1.1 86.04,43.48 89.55,46.99 89.55,65.42 v90.17,66.04
D-1  (via drill 0.55)
  Top 0.254: v112.39,54.61 110.49,54.61 109.73,55.37 109.73,56.39 109.98,56.64 109.98,64.01 LED4.3
  Bottom 0.254: U5.P$22 v112.39,54.61
D-2  (via drill 0.55)
  Top 0.254: v56.52,54.61 54.61,54.61 53.85,55.37 53.85,56.19 54.2,56.55 54.2,63.91 LED3.3
  Bottom 0.254: U3.P$22 v56.52,54.61
DIG1-1
  Bottom 0.254: U5.P$2 106.05,62.87 LED4.1
DIG1-2
  Bottom 0.254: U5.P$3 107.31,64.14 LED4.2
DIG1-3
  Bottom 0.254: LED4.6 115.32,63.25 109.73,63.25 108.59,62.1 U5.P$4
DIG1-4
  Bottom 0.254: LED4.8 119.94,62.79 110.54,62.79 109.86,62.1 U5.P$5
DIG2-1
  Bottom 0.254: U3.P$2 50.17,62.87 LED3.1
DIG2-2
  Bottom 0.254: U3.P$3 51.44,64.14 LED3.2
DIG2-3
  Bottom 0.254: LED3.6 59.44,63.25 53.85,63.25 52.7,62.1 U3.P$4
DIG2-4
  Bottom 0.254: LED3.8 64.06,62.79 54.66,62.79 53.98,62.1 U3.P$5
DP-1  (via drill 0.55)
  Top 0.254: v118.11,55.88 119.38,57.15 LED4.7
  Bottom 0.254: U5.P$18 117.48,55.24 v118.11,55.88
DP-2  (via drill 0.55)
  Top 0.254: v62.23,55.88 63.5,57.15 LED3.7
  Bottom 0.254: U3.P$18 61.59,55.24 v62.23,55.88
E-1  (via drill 0.55)
  Top 0.254: v114.3,54.61 115.06,55.37 115.06,64.01 LED4.5
  Bottom 0.254: U5.P$21 113.67,53.98 v114.3,54.61
E-2  (via drill 0.55)
  Top 0.254: v58.42,54.61 59.18,55.37 59.18,64.01 LED3.5
  Bottom 0.254: U3.P$21 57.79,53.98 v58.42,54.61
F-1  (via drill 0.55)
  Top 0.254: LED4.11 115.57,73.66 v115.57,54.61
  Bottom 0.254: U5.P$20 114.94,53.98 v115.57,54.61
F-2  (via drill 0.55)
  Top 0.254: LED3.11 59.69,73.66 v59.69,54.61
  Bottom 0.254: U3.P$20 59.06,53.98 v59.69,54.61
FLEX
  Top 0.254: S6.3 26.06,78.72 66.08,78.72 67.33,77.47 72.39,77.47 73.03,78.11 R2.1 76.27,78.81 77.47,80.01 85.47,80.01 J1.8
G-1  (via drill 0.55)
  Top 0.254: v106.3,58.42 106.3,63.42 105.46,64.26 105.46,65.28 106.68,66.5 LED4.15
  Bottom 0.254: U5.P$19 116.2,54.1 116.38,54.27 116.38,54.95 113.54,57.78 106.93,57.78 v106.3,58.42
G-2  (via drill 0.55)
  Top 0.254: v50.42,58.42 50.42,63.42 49.58,64.26 49.58,65.28 50.8,66.5 LED3.15
  Bottom 0.254: U3.P$19 60.33,54.1 60.5,54.27 60.5,54.95 57.66,57.78 51.05,57.78 v50.42,58.42
GND
  pour Top: -9.44,100 180.56,100 180.56,-5 -9.44,-5
  pour Bottom: -9.44,100 185.64,100 185.64,-5 -9.44,-5
LED_DI_3V3
  Bottom 0.254: R12.1 Q1.2 84.82,25.13 83.82,24.13 82.55,24.13 78.74,27.94 U$1.2
LED_DI_5V  (via drill 0.55)
  Top 0.254: D1.4 16.51,90.54 16.51,81.28 17.78,80.01 17.78,64.77 22.86,59.69 29.21,59.69 39.37,49.53 39.37,35.56 44.45,30.48 v73.66,30.48
  Bottom 0.254: Q1.3 80.28,29.21 76.2,29.21 74.93,30.48 | R13.1 74.93,30.48 | 74.93,30.48 v73.66,30.48
MISO  (via drill 0.55)
  Top 0.254: U$2.7 87.63,19.05 81.51,25.17 81.51,34.69 v81.28,34.92
  Bottom 0.254: U$1.12 81.03,49.78 81.03,42.87 81.28,42.62 v81.28,34.92
MOSI  (via drill 0.55)
  Top 0.254: v69.34,35.31 69.34,36.32 73.41,40.39 v73.41,41.4
  Bottom 0.254: v69.34,35.31 69.34,9.4 U$2.1 | v73.41,41.4 75.18,43.18 75.18,49.15 76.84,50.8 U$1.11
N$1
  Top 0.254: D19.A R8.1
N$2
  Top 0.254: D1.2 26.34,92.01 D2.4
N$3
  Top 0.254: D20.C R9.1
N$4
  Top 0.254: D21.C R10.1
N$6
  Top 0.254: D7.2 72.06,92.01 D8.4
N$7
  Top 0.254: D8.2 79.68,92.01 D9.4
N$8
  Top 0.254: D9.2 87.3,92.01 D10.4
N$9
  Top 0.254: D10.2 94.92,92.01 D11.4
N$10
  Top 0.254: D11.2 102.54,92.01 D12.4
N$11
  Top 0.254: D12.2 110.16,92.01 D13.4
N$12
  Top 0.254: D13.2 117.78,92.01 D14.4
N$13
  Top 0.254: D2.2 33.96,92.01 D3.4
N$14
  Top 0.254: D3.2 41.58,92.01 D4.4
N$15
  Top 0.254: D4.2 49.2,92.01 D5.4
N$16
  Top 0.254: D5.2 56.82,92.01 D6.4
N$17
  Top 0.254: D6.2 64.44,92.01 D7.4
N$18
  Top 0.254: D15.2 133.02,92.01 D16.4
N$19
  Top 0.254: D16.2 140.64,92.01 D17.4
N$20
  Top 0.254: D17.2 148.26,92.01 D18.4
N$21
  Top 0.254: D14.2 125.4,92.01 D15.4
NEUTRAL_LED
  Top 0.254: D21.A 98.43,53.07 98.43,55.24 92.46,61.21 92.46,70.1 86.17,76.39 J1.7
OLED_CS  (via drill 0.55)
  Top 0.254: v78.48,39.37 79.75,40.64 v82.55,40.64 | v82.55,45.85 80.14,48.26 U$1.10 | v78.87,31.24 78.87,22.73 v80.01,21.59
  Bottom 0.254: U$2.5 82.55,19.05 v80.01,21.59 | v82.55,40.64 v82.55,45.85 | v78.87,31.24 78.87,31.27 78.73,31.41 78.73,32.54 78.83,32.64 78.83,39.02 v78.48,39.37
OLED_DC  (via drill 0.55)
  Top 0.254: U$2.3 77.47,10.16 v83.82,16.51 | v90.17,17.78 90.17,25.4 91.44,26.67 93.57,26.67 94.84,27.94 94.84,46.13 U$1.15/A1
  Bottom 0.254: v83.82,16.51 85.09,17.78 v90.17,17.78
OLED_RESET  (via drill 0.55)
  Top 0.254: U$2.4 80.01,8.89 v83.82,12.7 | v95.25,24.13 95.25,48.26 U$1.14/A0
  Bottom 0.254: v83.82,12.7 86.36,15.24 92.71,15.24 95.25,17.78 v95.25,24.13
SCK  (via drill 0.55)
  Top 0.254: v70.1,32.26 70.1,34.54 v75.12,39.56 | v78.49,49.4 80.14,49.4 84.07,45.47 86.11,45.47 88.9,48.26 88.9,49.53 U$1.13
  Bottom 0.254: v78.49,49.4 76.07,49.4 75.69,49.02 75.69,41.91 75.12,41.34 v75.12,39.56 | v70.1,32.26 69.75,31.9 69.75,11.53 U$2.2
SCL  (via drill 0.55)
  Top 0.254: U$1.19/A5 91.44,39.37 91.44,40.64 90.32,41.76 75.78,41.76 74.76,42.77 55.71,42.77 51.9,46.58 v51.41,46.58
  Bottom 0.254: U$1.19/A5 93.53,38.92 95.76,38.92 R5.1 96.58,38.1 98.23,38.1 99.18,39.06 99.18,41.46 107.31,49.59 U5.P$26 | U3.P$26 51.44,46.61 v51.41,46.58
SDA  (via drill 0.55)
  Top 0.254: v50.17,48.9 55.88,43.18 74.93,43.18 75.95,42.16 91.19,42.16 U$1.18/A4
  Bottom 0.254: U$1.18/A4 93.47,39.88 95.69,39.88 R4.1 97.86,40.71 106.05,48.9 U5.P$27 | U3.P$27 v50.17,48.9
SDCARD_CD  (via drill 0.55)
  Top 0.254: U$2.8 88.04,8.48 88.04,19.22 82.04,25.21 v82.04,35.81 | v81.79,43.18 81.28,42.67 77.98,42.67 U$1.8
  Bottom 0.254: v81.79,43.18 81.79,36.07 v82.04,35.81
SDCARD_CS  (via drill 0.55)
  Top 0.254: U$2.6 85.09,21.02 79.27,26.83 79.27,30.58 79.62,30.93 79.62,32.09 v79.49,32.23
  Bottom 0.254: U$1.9 78.73,44.46 78.73,40.19 79.23,39.68 79.23,32.48 v79.49,32.23
VDD12V_DASH  (via drill 0.55)
  Top 0.508: J1.2 85.09,67.75 97.79,55.05 97.79,46.99 98.23,46.55 R10.2 | R9.2 84.26,46.55 83.82,46.99 83.82,63.25 83.95,63.37 | R8.2 72.2,46.55 72.64,46.99 | v78.74,73.66 78.17,74.23 R2.2
  Top 0.762: J1.2 85.09,64.52 83.95,63.37 72.64,52.07 72.64,46.99 72.64,44.7 72.39,44.45 v69.85,44.45
  Bottom 0.508: J1.2 83,70.48 82.04,70.48 78.87,73.66 v78.74,73.66
  Bottom 0.762: U1.1 68.84,45.46 v69.85,44.45
VDD_3V3  (via drill 0.55)
  Top 0.254: v83.19,35.69 83.56,35.31 83.56,30.23 84.58,29.21 v85.6,29.21
  Bottom 0.254: v85.6,29.21 84.82,28.43 Q1.1 R12.2 90.17,27.62 | U2.P5 83.59,37.11 83.19,36.7 v83.19,35.69 | 90.17,27.62 90.49,27.62 U$1.3.3V | 90.17,27.62 88.84,28.95 R14.2 R11.2 R7.2 R6.2
VIN  (via drill 0.55)
  Top 0.508: 93.98,20.32 U$1.VIN | C2.P$1 26.34,85.17 26.26,85.09 | 33.96,85.17 C3.P$1 | 41.58,85.17 C4.P$1 | 49.2,85.17 C5.P$1 | 56.82,85.17 C6.P$1 | 64.44,85.17 C7.P$1 | 72.06,85.17 C8.P$1 | 79.68,85.17 C9.P$1 | 87.3,85.17 C10.P$1 | 94.92,85.17 C11.P$1 | 102.54,85.17 C12.P$1 | 110.16,85.17 C13.P$1 | 117.78,85.17 C14.P$1 | 125.4,85.17 C15.P$1 | 133.02,85.17 C16.P$1 | 140.64,85.17 C17.P$1 | 148.26,85.17 C18.P$1 | 18.72,85.17 C1.P$1 | 93.98,20.32 95.25,19.05 U$2.10 | v82.8,32.13 82.8,30.23 86.36,26.67 v86.36,22.86 | 93.98,20.32 97.28,23.62 v97.28,34.92 97.28,41.4 v98.49,42.61
  Top 0.762: D2.1 26.34,85.17 | D3.1 33.96,85.17 | D4.1 41.58,85.17 | D5.1 49.2,85.17 | D6.1 56.82,85.17 | D7.1 64.44,85.17 | D8.1 72.06,85.17 | D9.1 79.68,85.17 | D10.1 87.3,85.17 | D11.1 94.92,85.17 | D12.1 102.54,85.17 | D13.1 110.16,85.17 | D14.1 117.78,85.17 | D15.1 125.4,85.17 | D16.1 133.02,85.17 | D17.1 140.64,85.17 | D18.1 148.26,85.17 | D1.1 18.72,85.17 | C1.P$1 26.26,85.09 | C2.P$1 C3.P$1 v39.37,85.09 C4.P$1 C5.P$1 C6.P$1 C7.P$1 C8.P$1 C9.P$1 C10.P$1 C11.P$1 C12.P$1 C13.P$1 C14.P$1 C15.P$1 C16.P$1 C17.P$1 C18.P$1
  Bottom 0.508: U$1.VIN 88.9,20.32 v86.36,22.86 82.55,22.86 78.74,26.67 76.71,26.67 73.78,29.59 73.29,29.59 72.78,30.11 72.78,30.85 73.28,31.35 73.28,34.29 | U3.P$28 41.91,50.8 | v82.8,32.13 83.95,33.28 84.46,33.28 84.77,33.59 U2.P3 | U1.2 71.56,40.9 R3.2 73.97,37.53 73.28,36.83 73.28,34.29 | U5.P$28 104.78,48.9 v98.49,42.61 R4.2 | R13.2 74.11,33.46 73.28,34.29 | R5.2 97.28,35.5 v97.28,34.92
  Bottom 0.762: v39.37,85.09 39.37,53.34 41.91,50.8 54.61,38.1 61.69,38.1 U1.2
WARM_LED  (via drill 0.55)
  Top 0.254: v86.36,53.71 D20.A
  Bottom 0.254: J1.6 81.92,76.39 85.06,73.25 85.06,71.25 86.99,69.33 86.99,66.69 86.36,66.06 v86.36,53.71

### Text on the board
tPlace: Lehigh FSAE X49_DASH rev 1F | * Made in Mohler by Pixies *